# Altium schematic sheet Main.SchDoc
size 271 x 238 mm; SheetNumber: 1
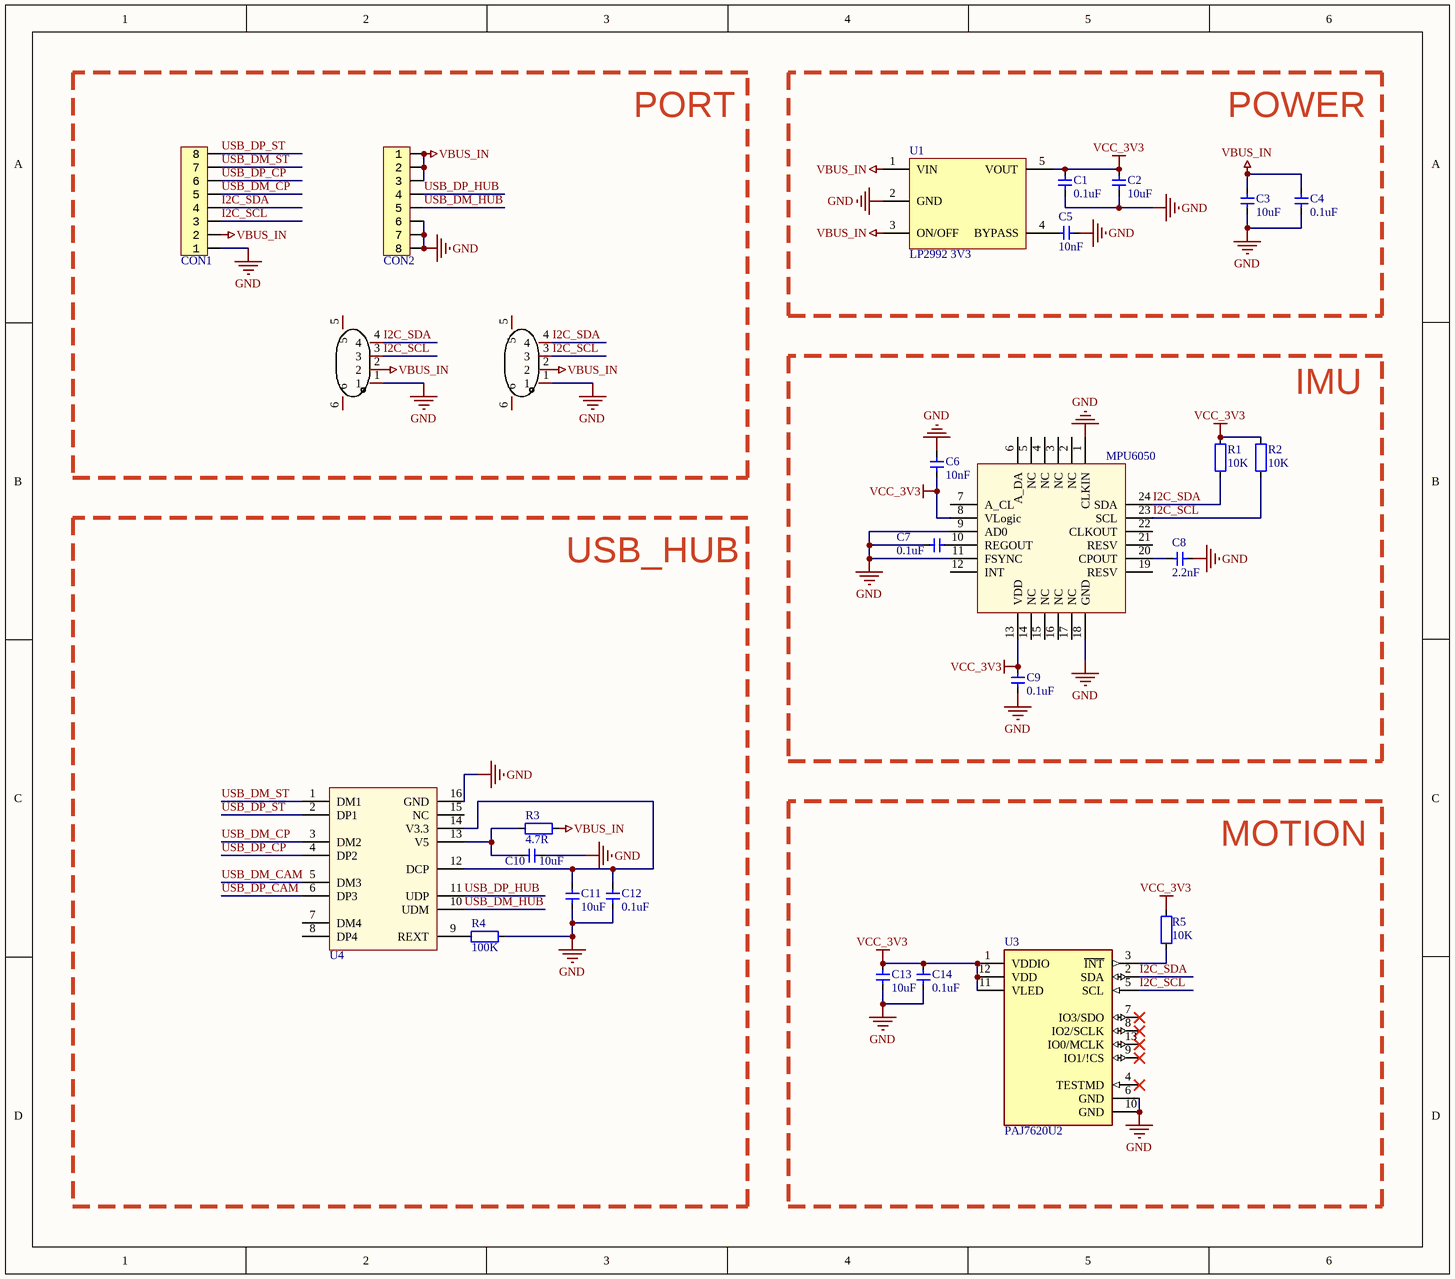
[diagram p0: Main.SchDoc]

## Parts
C1  0.1uF  [CAP_0402]
C2  10uF  [CAP_0402]
C3  10uF  [CAP_0402]
C4  0.1uF  [CAP_0402]
C5  10nF  [CAP_0402]
C6  10nF  [CAP_0402]
C7  0.1uF  [CAP_0402]
C8  2.2nF  [CAP_0402]
C9  0.1uF  [CAP_0402]
C10  10uF  [CAP_0402]
C11  10uF  [CAP_0402]
C12  0.1uF  [CAP_0402]
C13  10uF  [CAP_0402]
C14  0.1uF  [CAP_0402]
CON1  FFC_0.5_8  [FFC_0.5_8]  (value not drawn)
CON2  FFC_0.5_8  [FFC_0.5_8]  (value not drawn)
FPC1  0.5K-DX-4PWB  [FPC-SMD_4P-P0.50_DEALON_0.5K-DX-4PWB]  (value not drawn)
FPC2  0.5K-DX-4PWB  [FPC-SMD_4P-P0.50_DEALON_0.5K-DX-4PWB]  (value not drawn)
R1  10K  [RES_0402]
R2  10K  [RES_0402]
R3  4.7R  [RES_0402]
R4  100K  [RES_0402]
R5  10K  [RES_0402]
U1  LP2992 3V3  [SOT23-5]
U2  MPU6050  [QFN-24]
U3  PAJ7620U2  [PAJ7620U2]
U4  HS8836A  [SO-16N]  (value not drawn)

## Blocks framed on the sheet
PORT: CON1 CON2 FPC1 FPC2
POWER: C1-C5 U1
IMU: C6-C9 R1 R2 U2
USB_HUB: C10-C12 R3 R4 U4
MOTION: C13 C14 R5 U3

## Nets
GND: C1.1 C2.1 C3.1 C4.1 C5.1 C6.2 C7.2 C8.1 C9.1 C10.1 C11.2 C12.2 C13.2 C14.2 CON1.1 CON2.6 CON2.7 CON2.8 FPC1.1 FPC2.1 R4.1 U1.2(GND) U2.1(CLKIN) U2.9(AD0) U2.11(FSYNC) U2.18(GND) U3.6(GND) U3.10(GND) U4.16(GND)
VBUS_IN: C3.2 C4.2 CON1.2 CON2.1 CON2.2 CON2.3 FPC1.2 FPC2.2 R3.1 U1.1(VIN) U1.3(ON/OFF)
VCC_3V3: C1.2 C2.2 C6.1 C9.2 C13.1 C14.1 R1.2 R2.2 R5.1 U1.5(VOUT) U2.8(VLogic) U2.13(VDD) U3.1(VDDIO) U3.11(VLED) U3.12(VDD)
I2C_SCL: CON1.3 FPC1.3 FPC2.3 R2.1 U2.23(SCL) U3.5(SCL)
I2C_SDA: CON1.4 FPC1.4 FPC2.4 R1.1 U2.24(SDA) U3.2(SDA)
USB_DM_CAM: U4.5(DM3)
USB_DM_CP: CON1.5 U4.3(DM2)
USB_DM_HUB: CON2.5 U4.10(UDM)
USB_DM_ST: CON1.7 U4.1(DM1)
USB_DP_CAM: U4.6(DP3)
USB_DP_CP: CON1.6 U4.4(DP2)
USB_DP_HUB: CON2.4 U4.11(UDP)
USB_DP_ST: CON1.8 U4.2(DP1)
NetC5_2: C5.2 U1.4(BYPASS)
NetC7_1: C7.1 U2.10(REGOUT)
NetC8_2: C8.2 U2.20(CPOUT)
NetC10_2: C10.2 R3.2 U4.13(V5)
NetC11_1: C11.1 C12.1 U4.12(DCP) U4.14(V3.3)
NetR4_2: R4.2 U4.9(REXT)
NetR5_2: R5.2 U3.3(~{INT})

Not connected (* = marked no-connect by the designer): FPC1 5 6; FPC2 5 6; U2 2(NC) 3(NC) 4(NC) 5(NC) 6(A_DA) 7(A_CL) 12(INT) 14(NC) 15(NC) 16(NC) 17(NC) 19(RESV) 21(RESV) 22(CLKOUT); U3 4(TESTMD)* 7(IO3/SDO)* 8(IO2/SCLK)* 9(IO1/!CS)* 13(IO0/MCLK)*; U4 7(DM4) 8(DP4) 15(NC)

## Library data of the parts
C1-C14 = 电容-0402: Capacitor; Value: 0.1u
CON1 CON2 = FFC_0.5_8: FFC
FPC1 FPC2 = 0.5K-DX-4PWB: Manufacturer: HDGC(华德共创); Add into BOM: yes; Pitch: 0.5mm; Number of Contacts: 4; Locking Feature: 翻盖式; FFC, FCB Thickness: 0.3mm; Name: 0.5K-DX-4PWB; Symbol: 0.5K-DX-4PWB; Device: 0.5K-DX-4PWB; LCSC Part Name: 0.5mm P数:4 翻盖式 下接; Supplier Part: C2911830; Manufacturer Part: 0.5K-DX-4PWB; Supplier Footprint: SMD,P=0.5mm; JLCPCB Part Class: Extended Part; Datasheet: https://atta.szlcsc.com/upload/public/pdf/source/20211029/5210AEC837E1AC9B697C39805C1E664F.pdf; Supplier: LCSC; Convert to PCB: yes; Mounting Type: 卧贴; Contact Type: 下接; Height Above Board: 2mm; Operating Temperature Range: -20℃~+85℃
R1-R5 = 电阻-0402: Resistor; Value: 22R
U1 = LP2992: LDO
U2 = MPU6050: 六轴传感器
U3 = PAJ7620U2: module sensorPAJ7620U2 : 54/TRAY, 5400/BOX, 32400/CARTON; MF: Pixart; Value: *; Check_prices: https://www.snapeda.com/parts/PAJ7620U2/PixArt/view-part/?ref=eda; Price: None; Package: None; SnapEDA_Link: https://www.snapeda.com/parts/PAJ7620U2/PixArt/view-part/?ref=snap; Availability: Not in stock; MP: PAJ7620U2
U4 = HS8836A: USB2.0 HUB